# Altium project pc104_testing_board.PrjPcb
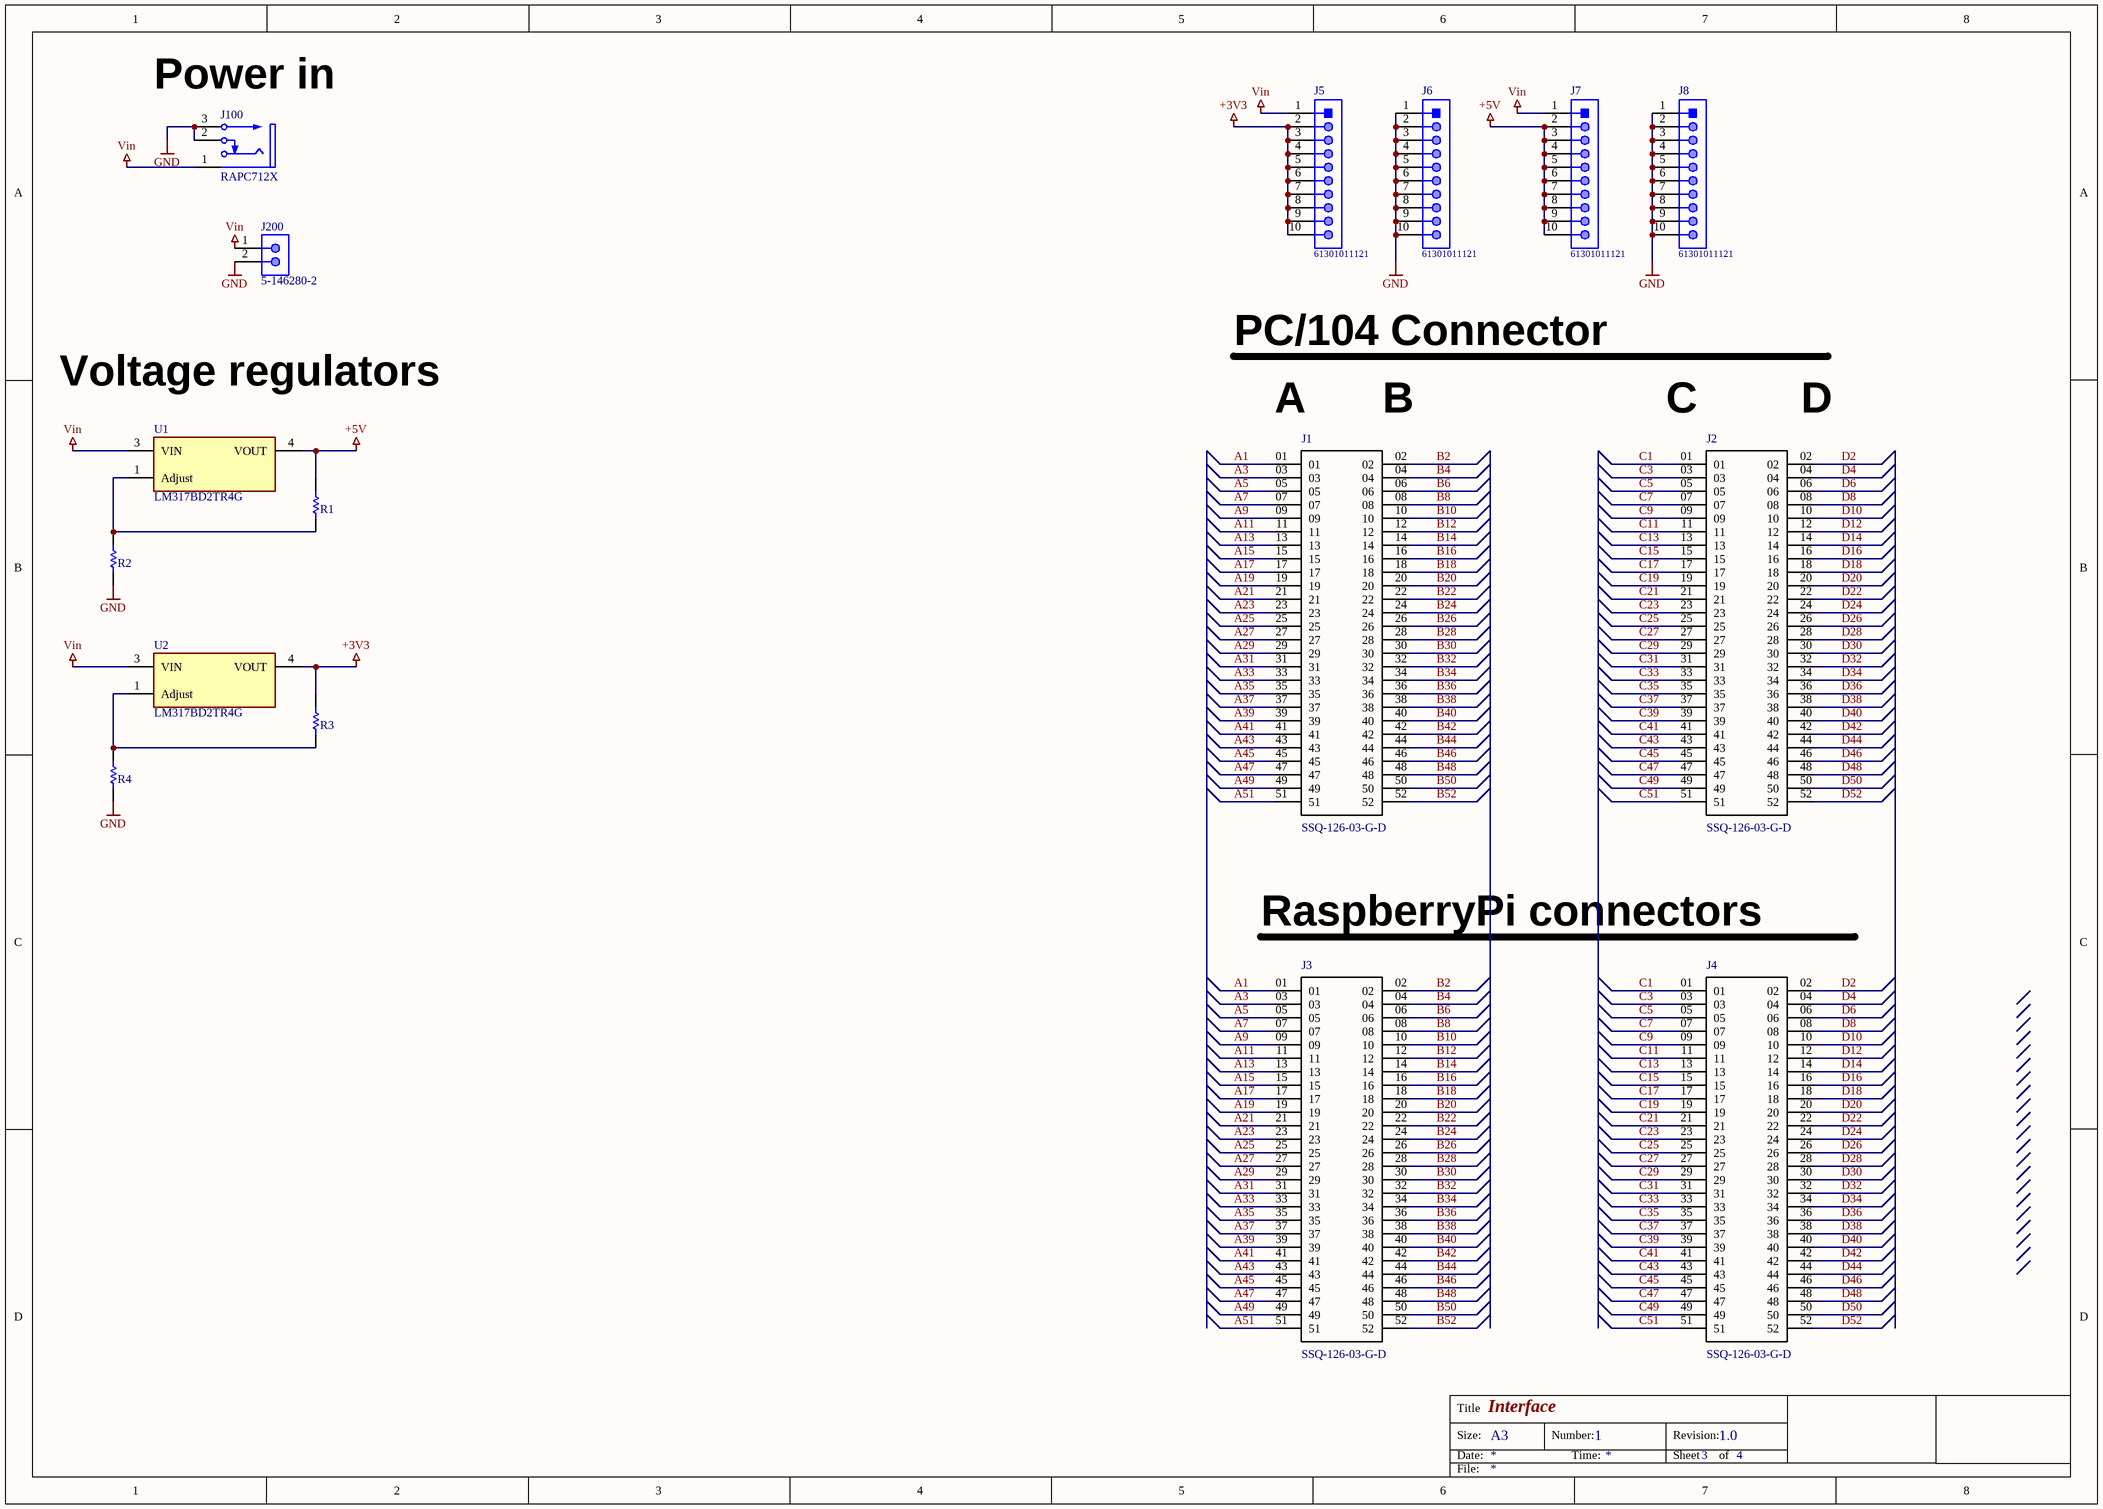
[diagram p0: Schem.SchDoc]
2 sheets, 38 parts. Net scope: global (net labels, ports and power ports of the same name join across sheets).
Board file: board.PcbDoc
Sheets:
  Schem.SchDoc
  Current_Measurement.SchDoc

## Sheet Schem.SchDoc: Interface
size A3; PageSetup: Record=PageOptions|CenterHorizontal=True|CenterVertical=True|PrintScale=1.00|XCorrection=1.00|YCorrection=1.00|PrintKind=1|BorderSize=5000000|LeftOffset=0|BottomOffset=0|Orientation=2|PaperLength=1000|PaperWidth=1000|Scale=100|PaperSource=15|PrintQuality=1200|MediaType=1|DitherType=10|PrintScaleMode=1|PaperKind=A4|PaperIndex=9; Organization: Altium Limited; Address1: L3, 12a Rodborough Rd; Address2: Frenchs Forest; Address3: NSW; Address4: Australia 2086; DocumentNumber: 1; Revision: 1.0; SheetNumber: 3; SheetTotal: 4

### Parts
J1  SSQ-126-03-G-D  [*SAMTEC_SSQ-126-03-G-D_SSQ-126-03-G-D(Primary)]
J2  SSQ-126-03-G-D  [*SAMTEC_SSQ-126-03-G-D_SSQ-126-03-G-D(Primary)]
J3  SSQ-126-03-G-D  [*SAMTEC_SSQ-126-03-G-D_SSQ-126-03-G-D(Primary)]
J4  SSQ-126-03-G-D  [*SAMTEC_SSQ-126-03-G-D_SSQ-126-03-G-D(Primary)]
J5  61301011121  [61301011121]
J6  61301011121  [61301011121]
J7  61301011121  [61301011121]
J8  61301011121  [61301011121]
J100  RAPC712X  [SWITCH-RAPC712X-3_V]
J200  5-146280-2  [TECO-5-146280-2_V]
R1  CRCW12064K70FKEA  [RESC3216X60X45ML15T20]  (value not drawn)
R2  CRCW12064K70FKEA  [RESC3216X60X45ML15T20]  (value not drawn)
R3  CRCW12064K70FKEA  [RESC3216X60X45ML15T20]  (value not drawn)
R4  CRCW12064K70FKEA  [RESC3216X60X45ML15T20]  (value not drawn)
U1  LM317BD2TR4G  [FP-936-03-MFG]
U2  LM317BD2TR4G  [FP-936-03-MFG]

### Nets
+3V3: J5.2 J5.3 J5.4 J5.5 J5.6 J5.7 J5.8 J5.9 J5.10 R3.2 U2.4(VOUT)
+5V: J7.2 J7.3 J7.4 J7.5 J7.6 J7.7 J7.8 J7.9 J7.10 R1.2 U1.4(VOUT)
GND: J6.1 J6.2 J6.3 J6.4 J6.5 J6.6 J6.7 J6.8 J6.9 J6.10 J8.1 J8.2 J8.3 J8.4 J8.5 J8.6 J8.7 J8.8 J8.9 J8.10 J100.2 J100.3 J200.2 R2.1 R4.1
Vin: J5.1 J7.1 J100.1 J200.1 U1.3(VIN) U2.3(VIN)
A1: J1.01 J3.01
A3: J1.03 J3.03
A5: J1.05 J3.05
A7: J1.07 J3.07
A9: J1.09 J3.09
A11: J1.11 J3.11
A13: J1.13 J3.13
A15: J1.15 J3.15
A17: J1.17 J3.17
A19: J1.19 J3.19
A21: J1.21 J3.21
A23: J1.23 J3.23
A25: J1.25 J3.25
A27: J1.27 J3.27
A29: J1.29 J3.29
A31: J1.31 J3.31
A33: J1.33 J3.33
A35: J1.35 J3.35
A37: J1.37 J3.37
A39: J1.39 J3.39
A41: J1.41 J3.41
A43: J1.43 J3.43
A45: J1.45 J3.45
A47: J1.47 J3.47
A49: J1.49 J3.49
A51: J1.51 J3.51
B2: J1.02 J3.02
B4: J1.04 J3.04
B6: J1.06 J3.06
B8: J1.08 J3.08
B10: J1.10 J3.10
B12: J1.12 J3.12
B14: J1.14 J3.14
B16: J1.16 J3.16
B18: J1.18 J3.18
B20: J1.20 J3.20
B22: J1.22 J3.22
B24: J1.24 J3.24
B26: J1.26 J3.26
B28: J1.28 J3.28
B30: J1.30 J3.30
B32: J1.32 J3.32
B34: J1.34 J3.34
B36: J1.36 J3.36
B38: J1.38 J3.38
B40: J1.40 J3.40
B42: J1.42 J3.42
B44: J1.44 J3.44
B46: J1.46 J3.46
B48: J1.48 J3.48
B50: J1.50 J3.50
B52: J1.52 J3.52
C1: J2.01 J4.01
C3: J2.03 J4.03
C5: J2.05 J4.05
C7: J2.07 J4.07
C9: J2.09 J4.09
C11: J2.11 J4.11
C13: J2.13 J4.13
C15: J2.15 J4.15
C17: J2.17 J4.17
C19: J2.19 J4.19
C21: J2.21 J4.21
C23: J2.23 J4.23
C25: J2.25 J4.25
C27: J2.27 J4.27
C29: J2.29 J4.29
C31: J2.31 J4.31
C33: J2.33 J4.33
C35: J2.35 J4.35
C37: J2.37 J4.37
C39: J2.39 J4.39
C41: J2.41 J4.41
C43: J2.43 J4.43
C45: J2.45 J4.45
C47: J2.47 J4.47
C49: J2.49 J4.49
C51: J2.51 J4.51
D2: J2.02 J4.02
D4: J2.04 J4.04
D6: J2.06 J4.06
D8: J2.08 J4.08
D10: J2.10 J4.10
D12: J2.12 J4.12
D14: J2.14 J4.14
D16: J2.16 J4.16
D18: J2.18 J4.18
D20: J2.20 J4.20
D22: J2.22 J4.22
D24: J2.24 J4.24
D26: J2.26 J4.26
D28: J2.28 J4.28
D30: J2.30 J4.30
D32: J2.32 J4.32
D34: J2.34 J4.34
D36: J2.36 J4.36
D38: J2.38 J4.38
D40: J2.40 J4.40
D42: J2.42 J4.42
D44: J2.44 J4.44
D46: J2.46 J4.46
D48: J2.48 J4.48
D50: J2.50 J4.50
D52: J2.52 J4.52
NetR1_1: R1.1 R2.2 U1.1(Adjust)
NetR3_1: R3.1 R4.2 U2.1(Adjust)

### Notes on the sheet
- (near J100) Power in
- PC/104 Connector
- Voltage regulators
- (near J1) A
- (near J1) B
- (near J2) C
- (near J2) D
- RaspberryPi connectors
- Title
- Size:
- Date:
- A3
- Number:
- Time:
- Revision:
- Sheet
- of
- File:

### Library data of the parts
J5-J8 = CMP-1502-01082-1: THT Vertical Pin Header WR-PHD, Pitch 2.54 mm, Single Row, 10 pins; Manufacturer: Wurth Elektronik; Contact Resistance: 20mOhm; Rated Current: 3A; Pitch: 2.54mm; Gender: Male; Pin Number: 10; Working Voltage: 250VAC; Withstanding Voltage: 500VAC; Manufacturer URL: http://www.we-online.de; Operating Temperature: -40to105degC; Datasheet URL: https://katalog.we-online.de/em/datasheet/6130xx11121.pdf; Row Number: Single; Orientation: Vertical; Part Number: 61301011121; Packaging: Bag; Package Reference: 61301011121; Mounting Technology: THT; Publisher: WurthElektronik
J100 = CMP-2000-05383-1: Conn Powerjack Mini R/A PCMT, 5 A, 3-Pin THD, RoHS; Manufacturer: Switchcraft; Gender: Male; Current Rating: 5A; Connector Type: Jack; Dynamic Catalog: SwitchcraftInc; Other Names: Q2387461 / Q2526383 / RAPC712X-ND / SC237; Internal Switch(s): SingleSwitch,NormallyClosed; Catalog Drawings: RAPC7(1,2)2XSide / RAPC7(1,2)2XTop; Plug/Mating Plug Diameter: 2.5mmID,5.5mmOD; Number of Positions/Contacts: 2Conductors,2Contacts; Shielding: Unshielded; Mating Products: SC1539-ND / -CONNPLUGMINIPWR2CONDBLK/RED / SC1051-ND / -CONNPLUGMINIPOWER2CONDBLACK; Mounting Type: ThroughHole,RightAngle; Manufacturer URL: http://www.switchcraft.com/; Contact Material: Brass; Standard Package: 2,500; RoHS Information: SwitchcraftRoHSInfo; Termination: SolderEyelet(s); Housing Color: Black; Datasheet Version: Rev. A, 08/2005; Family: Barrel-PowerConnectors; Housing Material: Thermoplastic; Color: Black; Datasheet URL: https://datasheet.ciiva.com/391/rapc712x-cd-391666.pdf; Category: Connectors,Interconnects; Contact Material - Plating: Nickel
J200 = CMP-2000-07492-1: Male Header, Pitch 2.54 mm, 1 x 2 Position, Height 8.21 mm, Tail Length 3.05 mm, -65 to 105 degC, RoHS, Bulk; Manufacturer: TE Connectivity; Mating Connector Lock: No(Without); Number of Positions: 2; Pitch: 2.54mm; PCB Mounting Orientation: Vertical; Keyed: No; Case\/Package: 100; Mating Post Length: 0.23inch; High Temperature Housing: Yes; Max Current Rating: 5A; PCB Thickness: 0.063inch; PCB Mount Retention: Without; Approvals: CSA; Current Rating: 3A; Radiation Hardening: No; Length: 4.67mm; Contact Mating Length: 0.23inch; Connector Type: Header; Number of Rows: 1; Termination Post Length: 0.12inch; Board Standoff: No(Without); Max Operating Temperature: 105degC; Contact Shape: Square; Selectively Loaded: No(Without); Gasket: No(Without); Number of Contacts: 2; Contact Gender: Male; Mating Alignment: No(Without); Manufacturer URL: http://www.te.com/; Datasheet URL: http://www.te.com/commerce/DocumentDelivery/DDEController?Action=showdoc&DocId=Customer+Drawing%7F146280%7FH1%7Fpdf%7FEnglish%7FENG_CD_146280_H1.pdf%7F5-146280-2; Mount: ThroughHole; Orientation: Straight; Packaging: Carton; Package Reference: 5-146280-2; Package Quantity: 500; Stabilizers: No(Without); Row Spacing: 2.54mm; Contact Material: CopperAlloy; Panel Mount Retention: No(Without); Datasheet Version: Rev. H1, 08/2016; Housing Colour: Black; Colour: Black; Package Description: Male Header, Pitch 2.54 mm, 1 x 2 Position, Height 8.21 mm, Tail Length 3.05 mm; Contact Plating: Matte; Housing Material: Polymer; Contact Protection: No(Without); Min Operating Temperature: -65degC; Mounting Technology: ThroughHole; Flammability Rating: UL94V-0; RoHSCompliant: true; Termination: ThroughHole; Depth: 2.34mm; High Speed Serial Data Connector: No
R1-R4 = CMP-2100-03618-1: Chip Resistor, 4.7 KOhm, +/- 1%, 0.25 W, -55 to 155 degC, 1206 (3216 Metric), RoHS, Tape and Reel; Manufacturer: Vishay Semiconductor; Power Rating: 250mW; Voltage Rating: 200V; Temperature Coefficient: 100ppm/degreesC; Package Quantity: 10; Composition: ThickFilm; REACH SVHC: Unknown; Mount: SurfaceMount; Max Operating Temperature: 155degC; Length: 3.2mm; Number of Terminations: 2; Case Code (Metric): 3216; Military Standard: Not; Width: 1.6mm; Datasheet Version: 41061.0; Max Power Dissipation: 250mW; Datasheet URL: http://www.vishay.com/docs/20035/dcrcwe3.pdf; Contact Plating: Tin; Case/Package: 1206; Height: 0.55mm; Package Reference: 1206.0; Lead Free: LeadFree; Weight: 0.000353oz; Package Description: 2-Pin Surface Mount Device, Body 3.15 x 1.6 mm; Min Operating Temperature: -55degC; Resistance: 4.7KOhm; Packaging: TapeandReel; Depth: 1.6mm; Tolerance: 1%; RoHSCompliant: true; Termination: SMD/SMT; Case Code (Imperial): 1206; Voltage Rating (DC): 200V; Radiation Hardening: No; Manufacturer URL: http://www.vishay.com/
U1 U2 = CMP-07128-000007-1: IC REG LINEAR POS ADJ 1.5A D2PAK; Manufacturer: ON Semiconductor; Output Voltage: 1.2-37V; Dropout Voltage: 2.25V; Max Junction Temp: +125°C; Standoff Height: 0mm; Automotive Grade: Grade 1; Number Of Outputs: 1; Output Type: AdjustableProgrammable; Max Supply Voltage: 40V; Min Supply Voltage: 2.8V; Lead Free: Yes; Automotive: Yes; ComponentLink2Description: Datasheet; Output Current: 1.5A; Digikey Description: IC REG LINEAR POS ADJ 1.5A D2PAK; Device Class L3: Voltage Regulators - Linear; Temperature Range High: +125°C; Category: IC; Manufacturer Part Number: LM317BD2TR4G; Mouser Description: Linear Voltage Regulators 1.5A ADJ 1.2-37V Positive; Temperature Range Low: -40°C; Device Class L2: Power Management ICs; Height: 4.826mm; ComponentLink2URL: https://www.onsemi.com/pub/Collateral/LM317-D.PDF; Device Class L1: Integrated Circuits (ICs); Package: 936-03; Footprint Url: https://www.onsemi.com/pub/Collateral/936-03.PDF; RoHS: TRUE; Temperature: -40°C to +125°C; Octopart: https://octopart.com/lm317bd2tr4g-on+semiconductor-530493
J1-J4 = SSQ-126-03-G-D: Check_prices: https://www.snapeda.com/parts/SSQ-126-03-G-D/Samtec/view-part/3311208/?ref=eda; SnapEDA_Link: https://www.snapeda.com/parts/SSQ-126-03-G-D/Samtec/view-part/3311208/?ref=snap; Value: *

## Sheet Current_Measurement.SchDoc
size A4
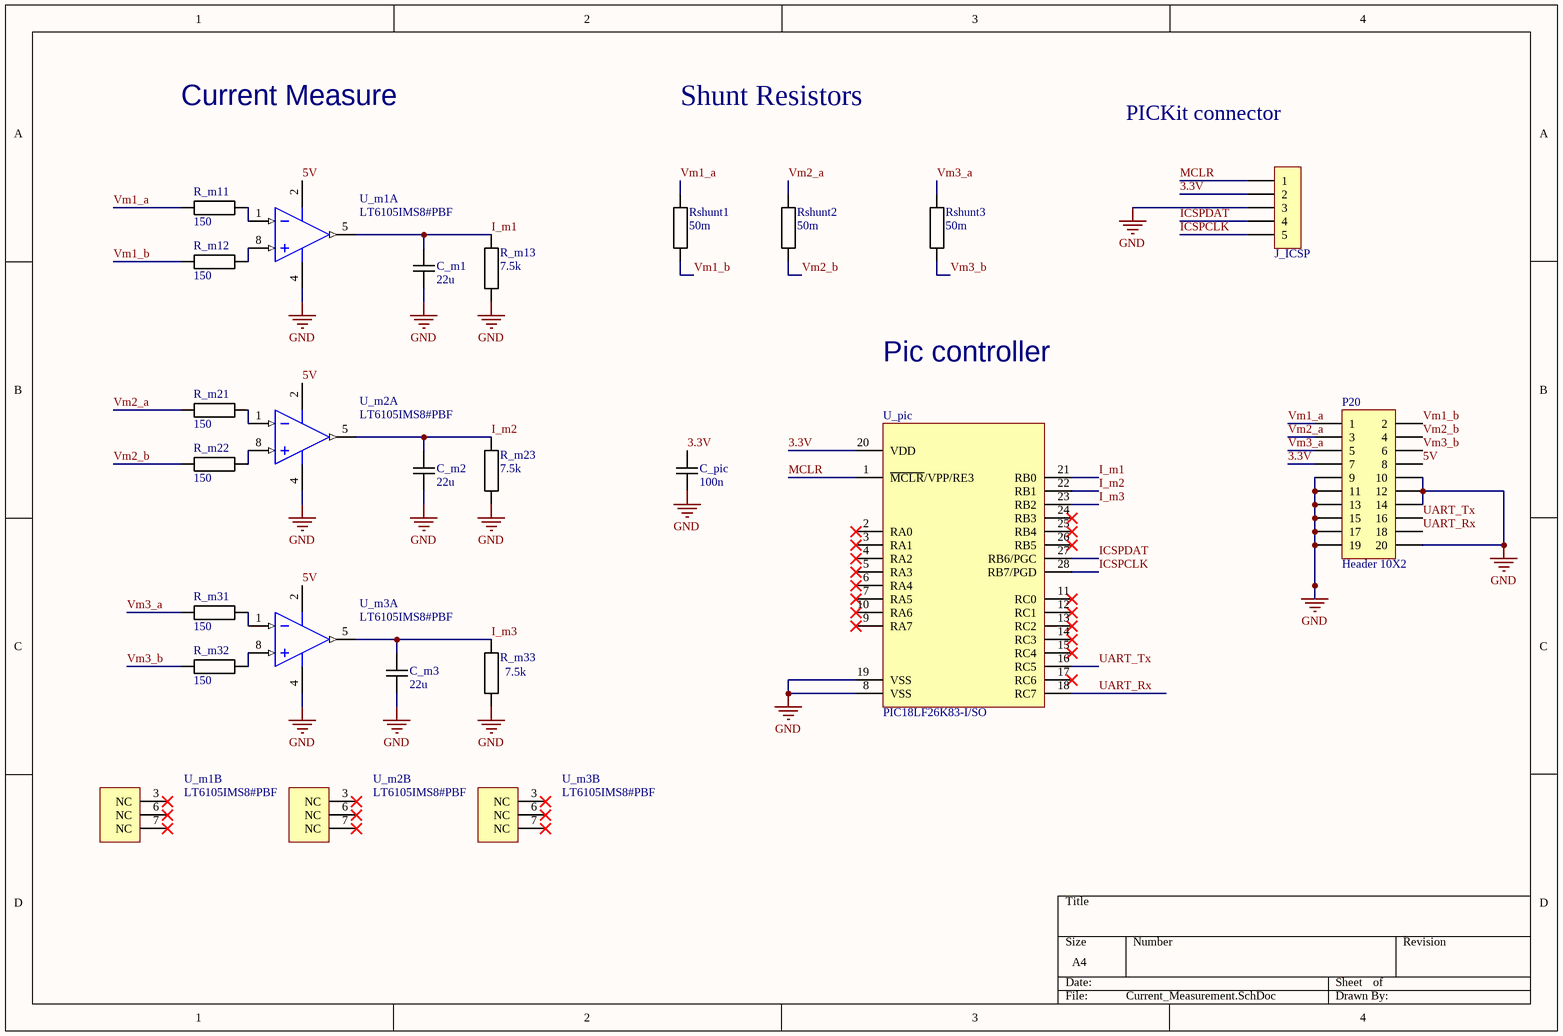
[diagram p1: Current_Measurement.SchDoc]

### Parts
C_m1  22u  [RESC3115X65N]
C_m2  22u  [RESC3115X65N]
C_m3  22u  [RESC3115X65N]
C_pic  100n  [RESC3115X65N]
J_ICSP  *  [HDR1X5]  (value not drawn)
P20  Header 10X2  [HDR2X10]
R_m11  150  [RESC3115X65N]
R_m12  150  [RESC3115X65N]
R_m13  7.5k  [RESC3115X65N]
R_m21  150  [RESC3115X65N]
R_m22  150  [RESC3115X65N]
R_m23  7.5k  [RESC3115X65N]
R_m31  150  [RESC3115X65N]
R_m32  150  [RESC3115X65N]
R_m33  7.5k  [RESC3115X65N]
Rshunt1  50m  [RESC3115X65N]
Rshunt2  50m  [RESC3115X65N]
Rshunt3  50m  [RESC3115X65N]
U_m1  LT6105IMS8#PBF  [LT-MS8-8_L]  (parts A,B of 2)
U_m2  LT6105IMS8#PBF  [LT-MS8-8_L]  (parts A,B of 2)
U_m3  LT6105IMS8#PBF  [LT-MS8-8_L]  (parts A,B of 2)
U_pic  PIC18LF26K83-I/SO  [SOIC127P1030X265-28N]

### Nets
GND: C_m1.1 C_m2.1 C_m3.1 C_pic.1 J_ICSP.3 P20.9 P20.10 P20.11 P20.12 P20.13 P20.14 P20.15 P20.17 P20.19 P20.20 R_m13.1 R_m23.1 R_m33.1 U_m1.4(V-) U_m2.4(V-) U_m3.4(V-) U_pic.8(VSS) U_pic.19(VSS)
3.3V: C_pic.2 J_ICSP.2 P20.7 U_pic.20(VDD)
5V: P20.8 U_m1.2(V+) U_m2.2(V+) U_m3.2(V+)
I_m1: C_m1.2 R_m13.2 U_m1.5(VOUT) U_pic.21(RB0)
I_m2: C_m2.2 R_m23.2 U_m2.5(VOUT) U_pic.22(RB1)
I_m3: C_m3.2 R_m33.2 U_m3.5(VOUT) U_pic.23(RB2)
ICSPCLK: J_ICSP.5 U_pic.28(RB7/PGD)
ICSPDAT: J_ICSP.4 U_pic.27(RB6/PGC)
MCLR: J_ICSP.1 U_pic.1(~{MCLR}/VPP/RE3)
UART_Rx: P20.18 U_pic.18(RC7)
UART_Tx: P20.16 U_pic.16(RC5)
Vm1_a: P20.1 R_m11.1 Rshunt1.2
Vm1_b: P20.2 R_m12.1 Rshunt1.1
Vm2_a: P20.3 R_m21.1 Rshunt2.2
Vm2_b: P20.4 R_m22.1 Rshunt2.1
Vm3_a: P20.5 R_m31.1 Rshunt3.2
Vm3_b: P20.6 R_m32.1 Rshunt3.1
NetR_m11_2: R_m11.2 U_m1.1(-IN)
NetR_m12_2: R_m12.2 U_m1.8(+IN)
NetR_m21_2: R_m21.2 U_m2.1(-IN)
NetR_m22_2: R_m22.2 U_m2.8(+IN)
NetR_m31_2: R_m31.2 U_m3.1(-IN)
NetR_m32_2: R_m32.2 U_m3.8(+IN)

Not connected (* = marked no-connect by the designer): U_m1 3(NC)* 6(NC)* 7(NC)*; U_m2 3(NC)* 6(NC)* 7(NC)*; U_m3 3(NC)* 6(NC)* 7(NC)*; U_pic 2(RA0)* 3(RA1)* 4(RA2)* 5(RA3)* 6(RA4)* 7(RA5)* 9(RA7)* 10(RA6)* 11(RC0)* 12(RC1)* 13(RC2)* 14(RC3)* 15(RC4)* 17(RC6)* 24(RB3)* 25(RB4)* 26(RB5)*

### Notes on the sheet
- Current Measure
- Shunt Resistors
- PICKit connector
- Pic controller

### Library data of the parts
C_m1-C_m3 C_pic = Capacitor
  C_m1-C_m3: Value: 22u
  C_pic: Value: 100n
J_ICSP = PinHeader1x5: Plug connector; Value: *
P20 = Header 10X2: Header, 10-Pin, Dual row; LatestRevisionDate: 17-Jul-2002; LatestRevisionNote: Re-released for DXP Platform.; Publisher: Altium Limited
R_m11-R_m13 R_m21-R_m23 R_m31-R_m33 Rshunt1-Rshunt3 = Resistor
  R_m11 R_m12 R_m21 R_m22 R_m31 R_m32: Value: 150
  R_m13 R_m23 R_m33: Value: 7.5k
  Rshunt1-Rshunt3: Value: 50m
U_m1-U_m3 = LT6105IMS8#PBF: Single Channel, Precision, Rail-to-Rail Input Current Sense Amplifier, 0.1 MHz Typical GBW, 2.85 to 36 V, 8-Pin SOP (MS8-8), Industrial, Pb-Free; Linear Technology Part Number: LT6105; Manufacturer: Linear Technology; Vs Max (V): 36; Vos (mV) Guaranteed: 0.3; Channels (#): 1; Vs Min (V): 2.85; Vos (mV) Typical: 0.1; Is (mA) Typical: 0.2; PartNumber: LT6105IMS8#PBF; Type: CSA; PackageVersion: Rev G; ComponentLink1Description: Manufacturer URL; ComponentLink2Description: Datasheet; DatasheetVersion: Rev. A; ComponentLink3URL: http://cds.linear.com/docs/en/packaging/05081610_G_SO8.pdf; ComponentLink1URL: http://www.linear.com/; RevisionNote: URLs updated; ComponentLink2URL: http://cds.linear.com/docs/en/datasheet/6105fa.pdf; ComponentLink3Description: Package Specification; RoHS: Pb-Free; Mounting Technology: Surface Mount; PackageReference: LT-MS8-8; PackageDescription: 8-Lead Plastic Small Outline, Body 3.9 x 4.9 mm, Pitch 1.27 mm; GBW (MHz) Typical: 0.1
U_pic = PIC18F26K83-_/SO: Flash Microcontrollers  with 10-Bit A/D and nanoWatt Technology; Value: PIC18LF26K83-I/SO

## Nets that join several sheets
GND: Schem (25 pins), Current_Measurement (23 pins)